# Altium schematic sheet LCD_touch_conn.SchDoc
size Letter
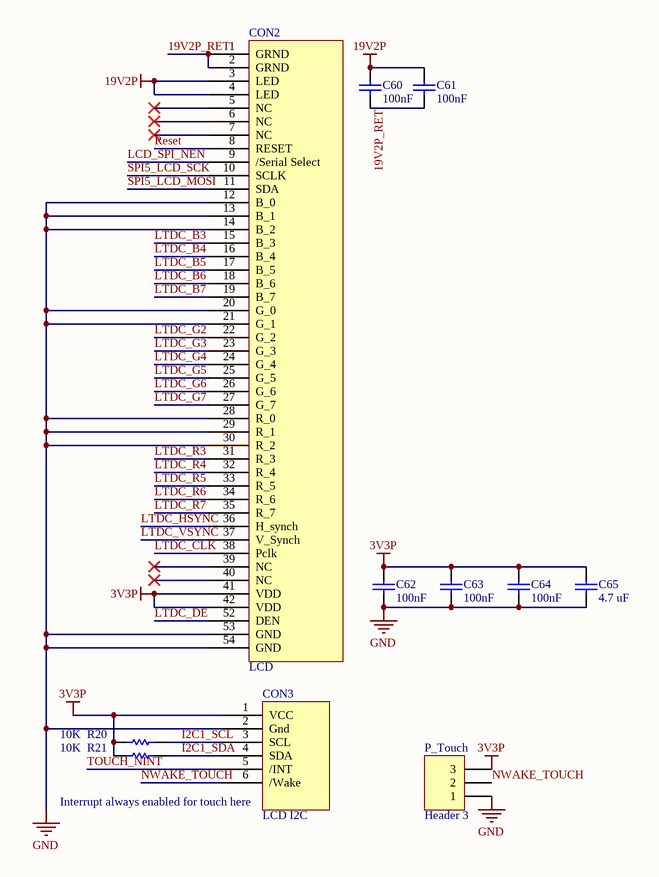
[diagram p0: LCD_touch_conn.SchDoc]

## Parts
C60  100nF  [C0805]
C61  100nF  [C0805]
C62  100nF  [C0805]
C63  100nF  [C0805]
C64  100nF  [C0805]
C65  4.7 uF  [C0805]
CON2  LCD  [Molex54 - duplicate2]
CON3  LCD I2C  [Molex6]
P_Touch  Header 3  [HDR1X3]
R20  10K  [6-0805_M]
R21  10K  [6-0805_M]

## Nets
3V3P: C62.2 C63.2 C64.2 C65.2 CON2.41(VDD) CON2.42(VDD) CON3.1(VCC) P_Touch.3 R20.1 R21.1
19V2P: C60.2 C61.2 CON2.3(LED) CON2.4(LED)
GND: C62.1 C63.1 C64.1 C65.1 CON2.12(B_0) CON2.13(B_1) CON2.14(B_2) CON2.20(G_0) CON2.21(G_1) CON2.28(R_0) CON2.29(R_1) CON2.30(R_2) CON2.53(GND) CON2.54(GND) CON3.2(Gnd) P_Touch.1
19V2P_RET: C60.1 C61.1 CON2.1(GRND) CON2.2(GRND)
I2C1_SCL: CON3.3(SCL) R20.2
I2C1_SDA: CON3.4(SDA) R21.2
LCD_SPI_NEN: CON2.9(/Serial_Select)
LTDC_B3: CON2.15(B_3)
LTDC_B4: CON2.16(B_4)
LTDC_B5: CON2.17(B_5)
LTDC_B6: CON2.18(B_6)
LTDC_B7: CON2.19(B_7)
LTDC_CLK: CON2.38(Pclk)
LTDC_DE: CON2.52(DEN)
LTDC_G2: CON2.22(G_2)
LTDC_G3: CON2.23(G_3)
LTDC_G4: CON2.24(G_4)
LTDC_G5: CON2.25(G_5)
LTDC_G6: CON2.26(G_6)
LTDC_G7: CON2.27(G_7)
LTDC_HSYNC: CON2.36(H_synch)
LTDC_R3: CON2.31(R_3)
LTDC_R4: CON2.32(R_4)
LTDC_R5: CON2.33(R_5)
LTDC_R6: CON2.34(R_6)
LTDC_R7: CON2.35(R_7)
LTDC_VSYNC: CON2.37(V_Synch)
NWAKE_TOUCH: CON3.6(/Wake) P_Touch.2
Reset: CON2.8(RESET)
SPI5_LCD_MOSI: CON2.11(SDA)
SPI5_LCD_SCK: CON2.10(SCLK)
TOUCH_NINT: CON3.5(/INT)

Not connected (* = marked no-connect by the designer): CON2 5(NC)* 6(NC)* 7(NC)* 39(NC)* 40(NC)*

## Notes on the sheet
- (near CON3) Interrupt always enabled for touch here

## Library data of the parts
C60-C65 = Cap: Capacitor; Published: 8-Jun-2000; LatestRevisionDate: 17-Jul-2002; LatestRevisionNote: Re-released for DXP Platform.; PackageReference: RAD-0.3; Publisher: Altium Limited; PackageDescription: Radial Cap, Thru-Hole; 2 Leads; 0.3 in Pin Spacing
  C60-C64: Value: 100nF
  C65: Value: 4.7 uF
CON2 = LCD: pin to pad: 1>A1 2>A2 3>A3 4>A4 5>A5 6>A6 7>A7 8>A8 9>A9 10>A10 11>A11 12>A12 13>A13 14>A14 15>A15 16>A16 17>A17 18>A18 19>A19 20>A20 21>A21 22>A22 23>A23 24>A24 25>A25 26>A26 27>A27 28>A28 29>A29 30>A30 31>A31 32>A32 33>A33 34>A34 35>A35 36>A36 37>A37 38>A38 39>A39 40>A40 41>A41 42>A42 52>A52 53>A53 54>A54
P_Touch = Header 3: Header, 3-Pin; LatestRevisionDate: 17-Jul-2002; LatestRevisionNote: Re-released for DXP Platform.; Publisher: Altium Limited
R20 R21 = Res1: Resistor; Published: 8-Jun-2000; LatestRevisionDate: 17-Jul-2002; LatestRevisionNote: Re-released for DXP Platform.; PackageReference: AXIAL-0.3; Publisher: Altium Limited; PackageDescription: Axial Device, Thru-Hole; 2 Leads; 0.3 in Pin Spacing; Value: 10K